# EAGLE board Titan_6L_v1p4 (EAGLE 9.6.2), part 1 of 2
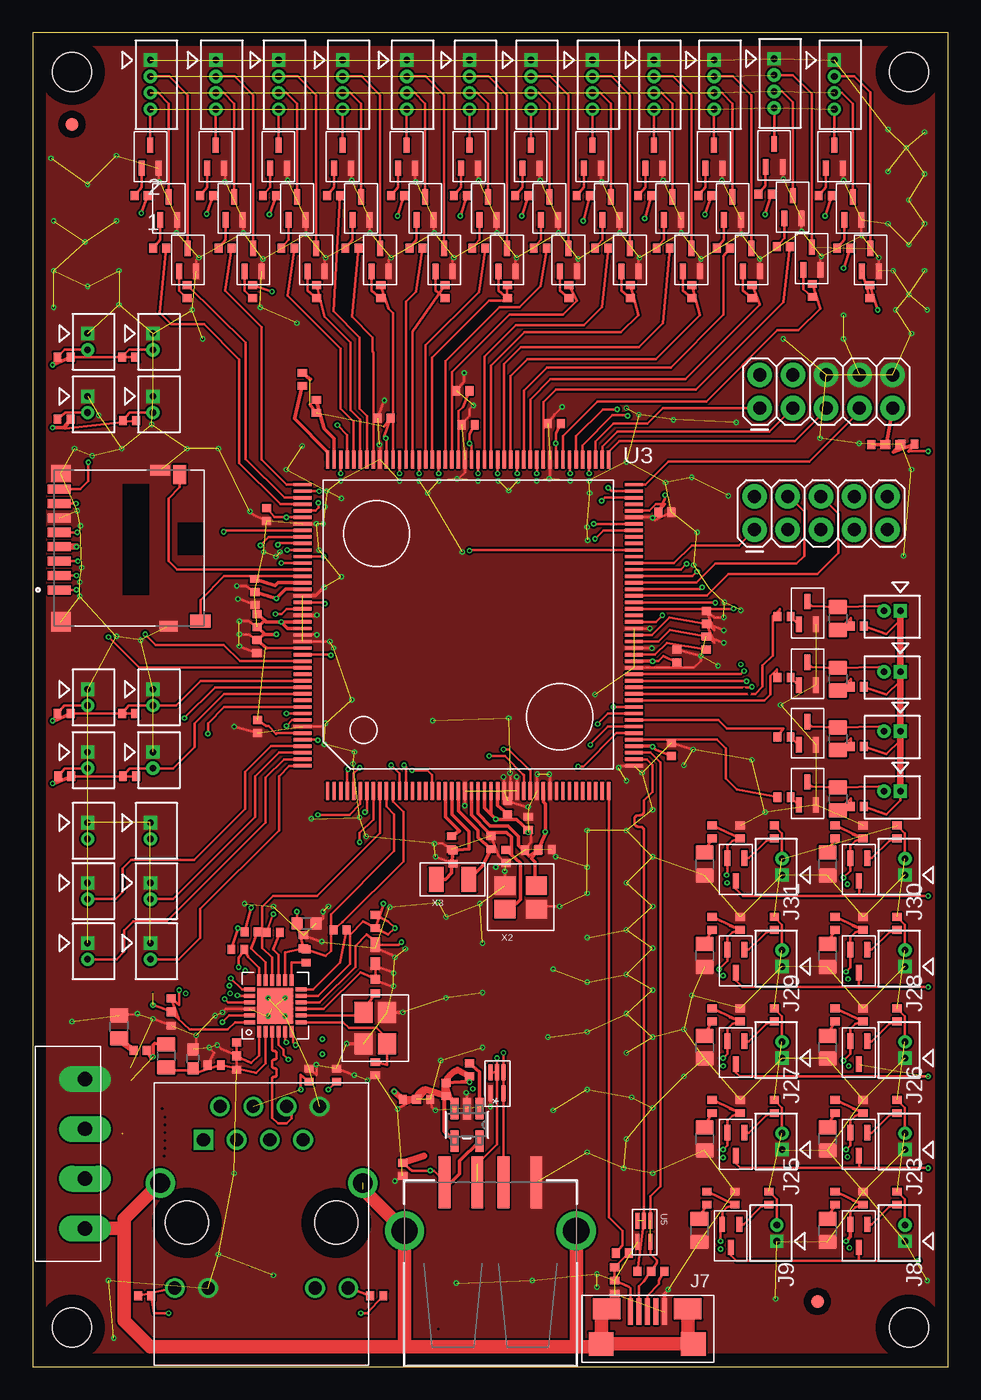
[diagram p7: board, top side]
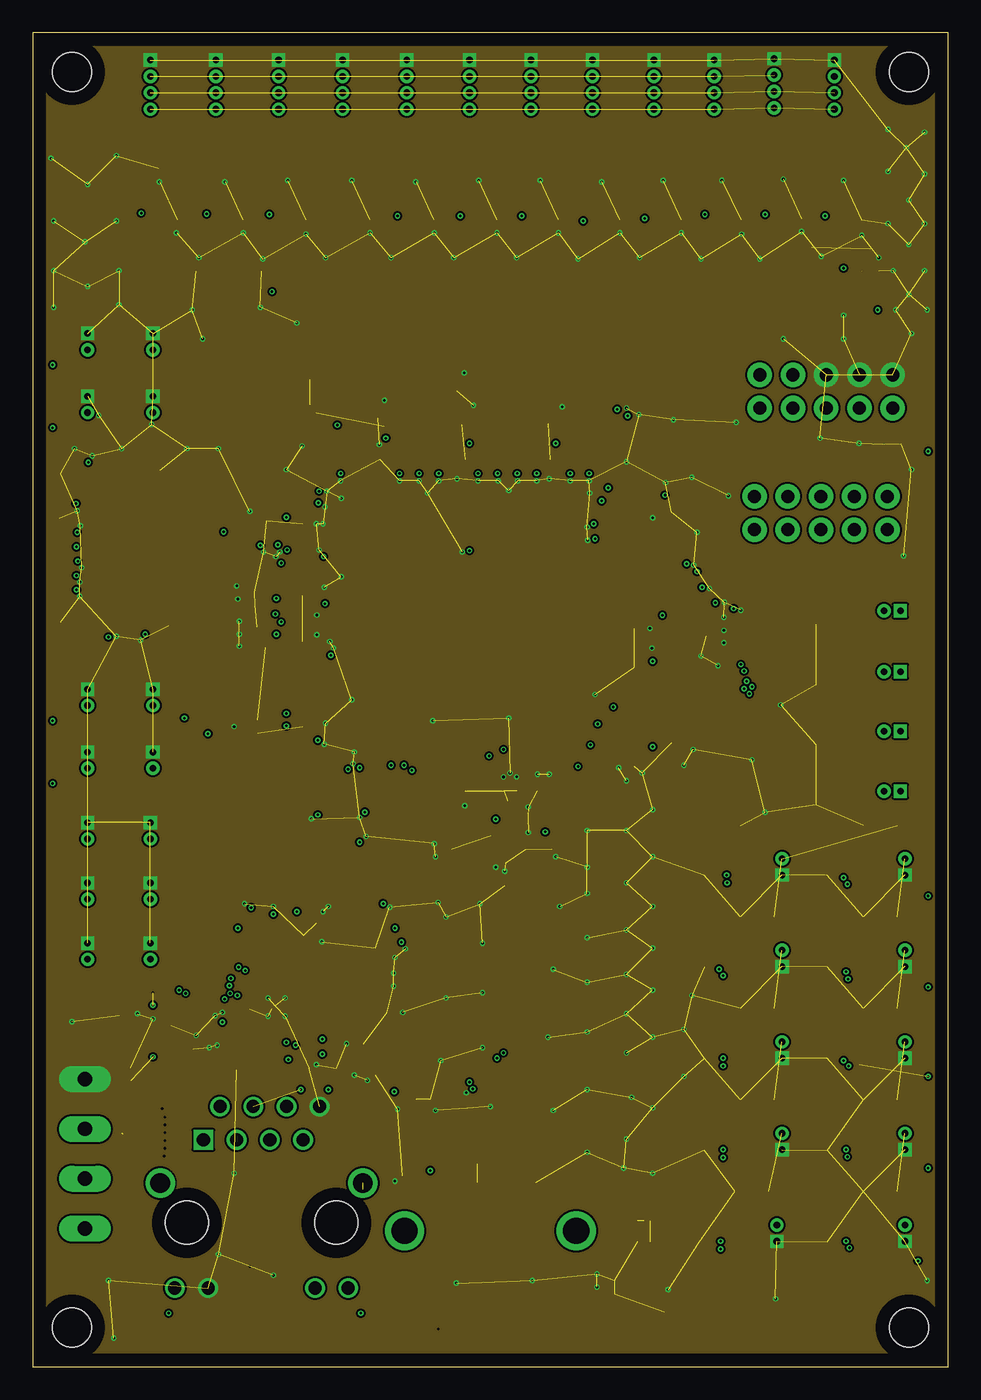
[diagram p8: board, inner layer GND]
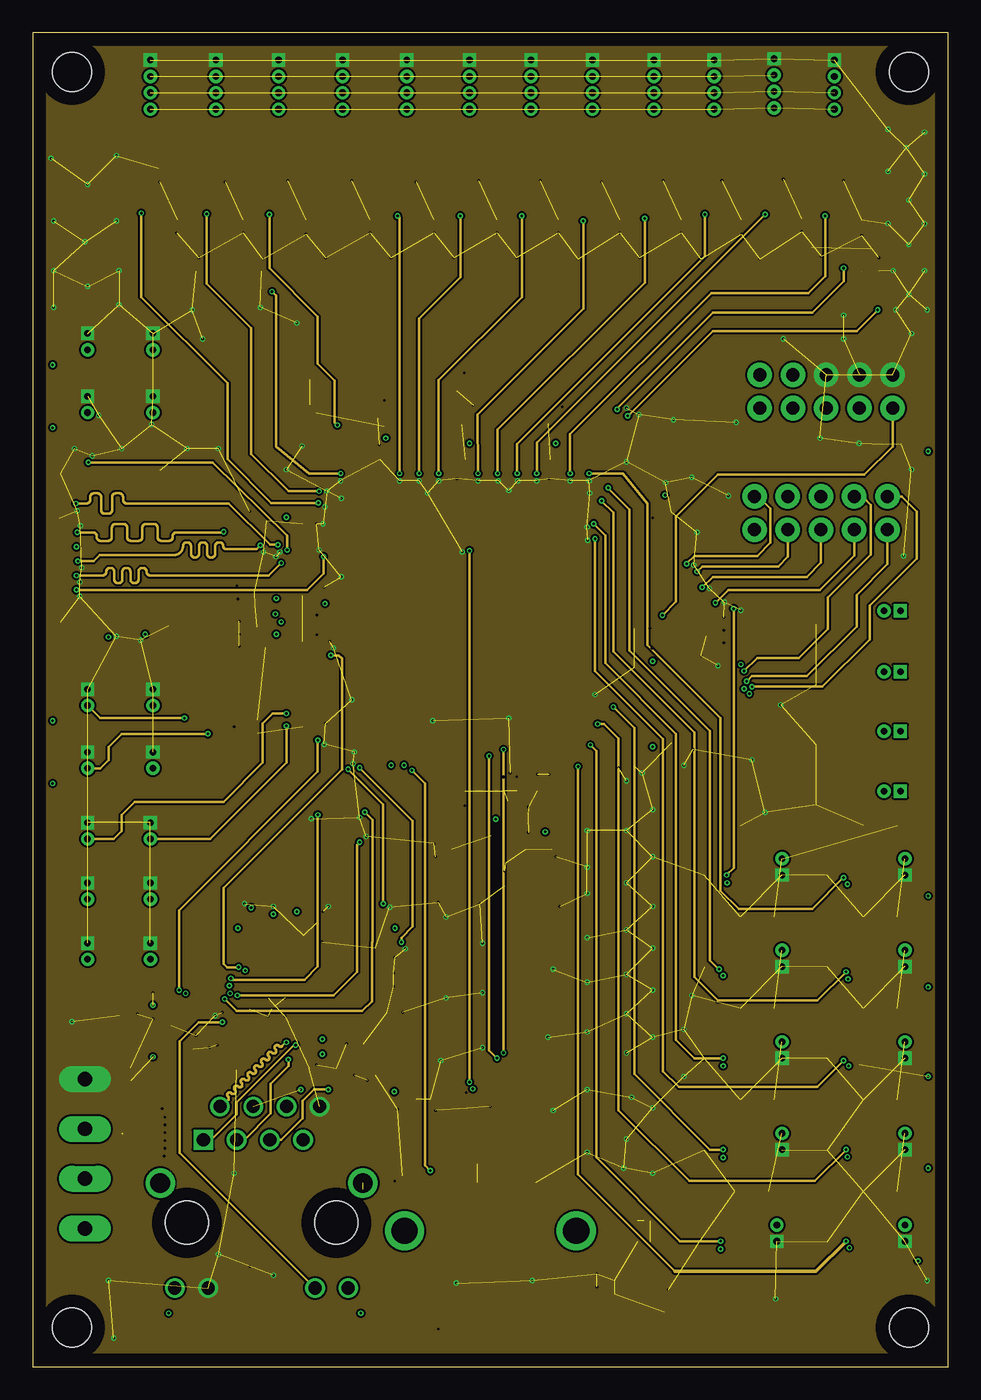
[diagram p9: board, inner layer Route3]
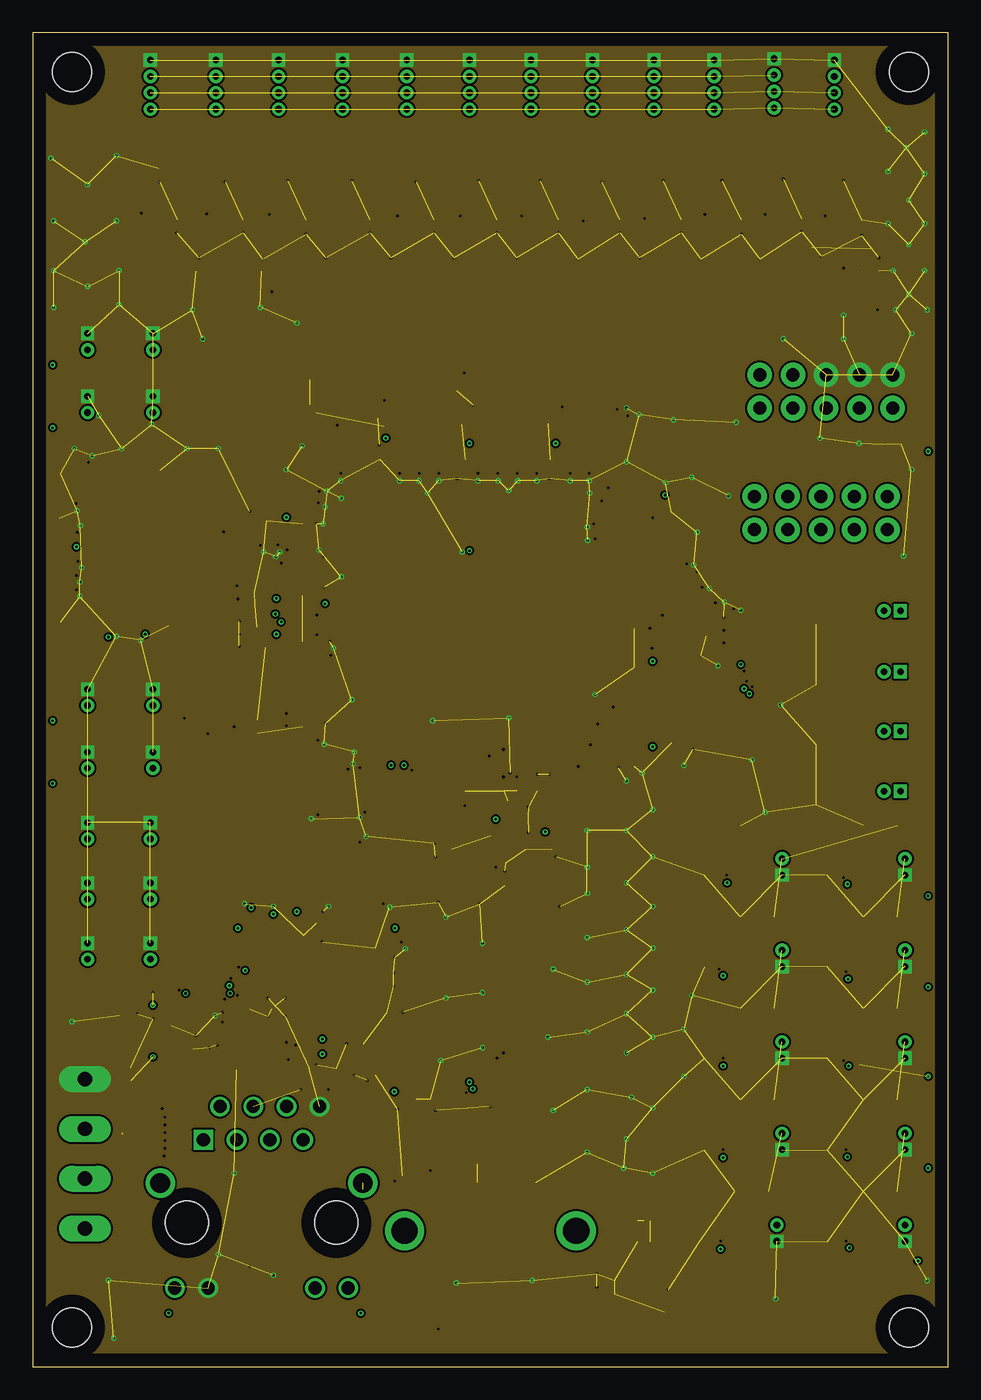
[diagram p10: board, inner layer GND14]
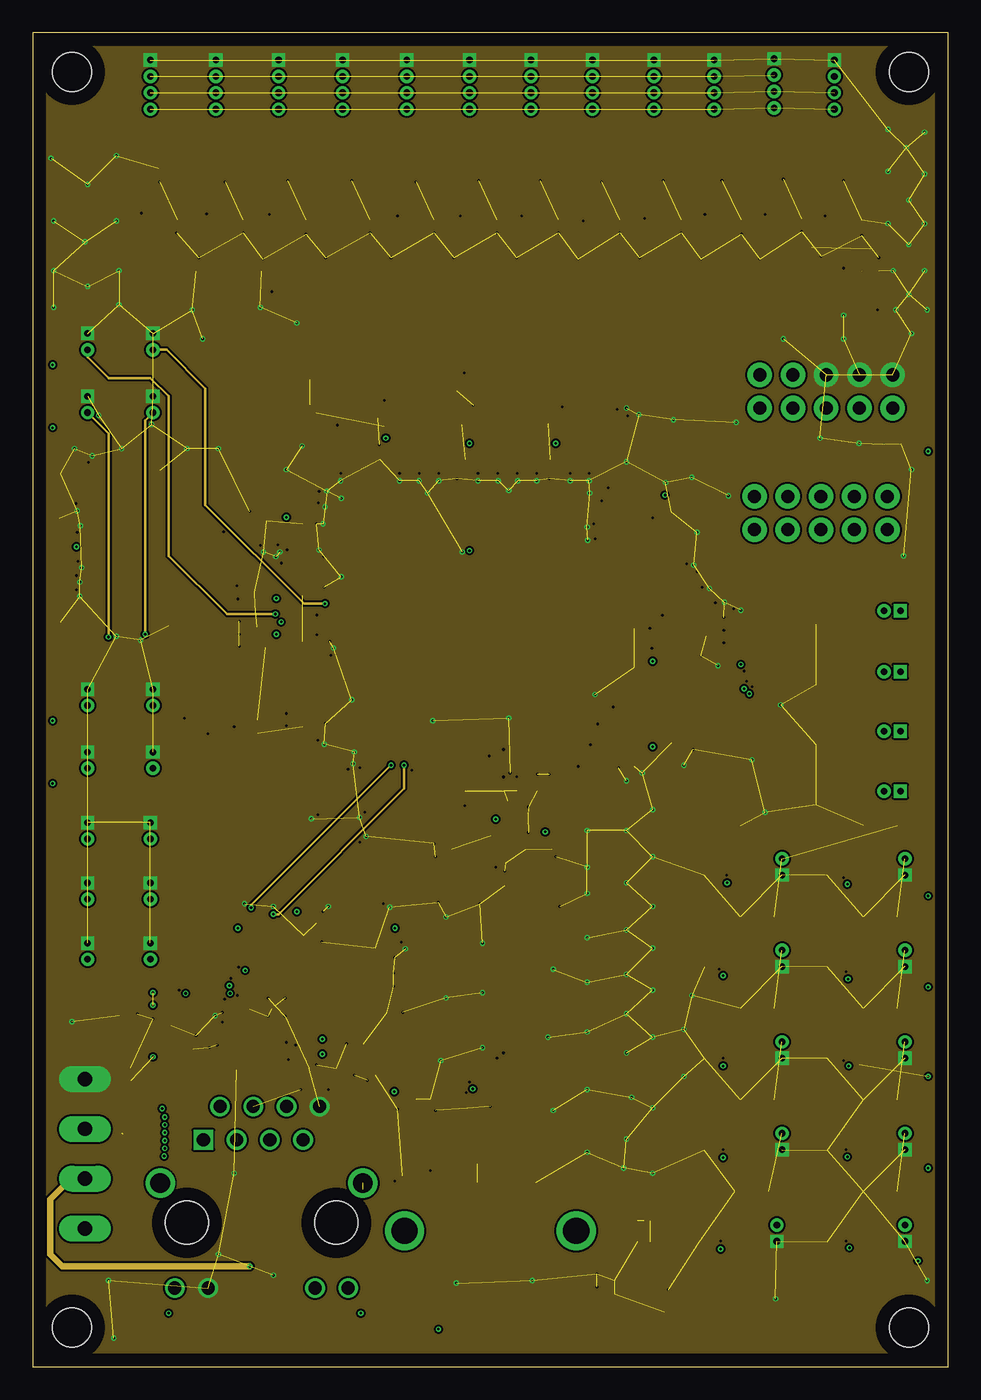
[diagram p11: board, inner layer Route15]
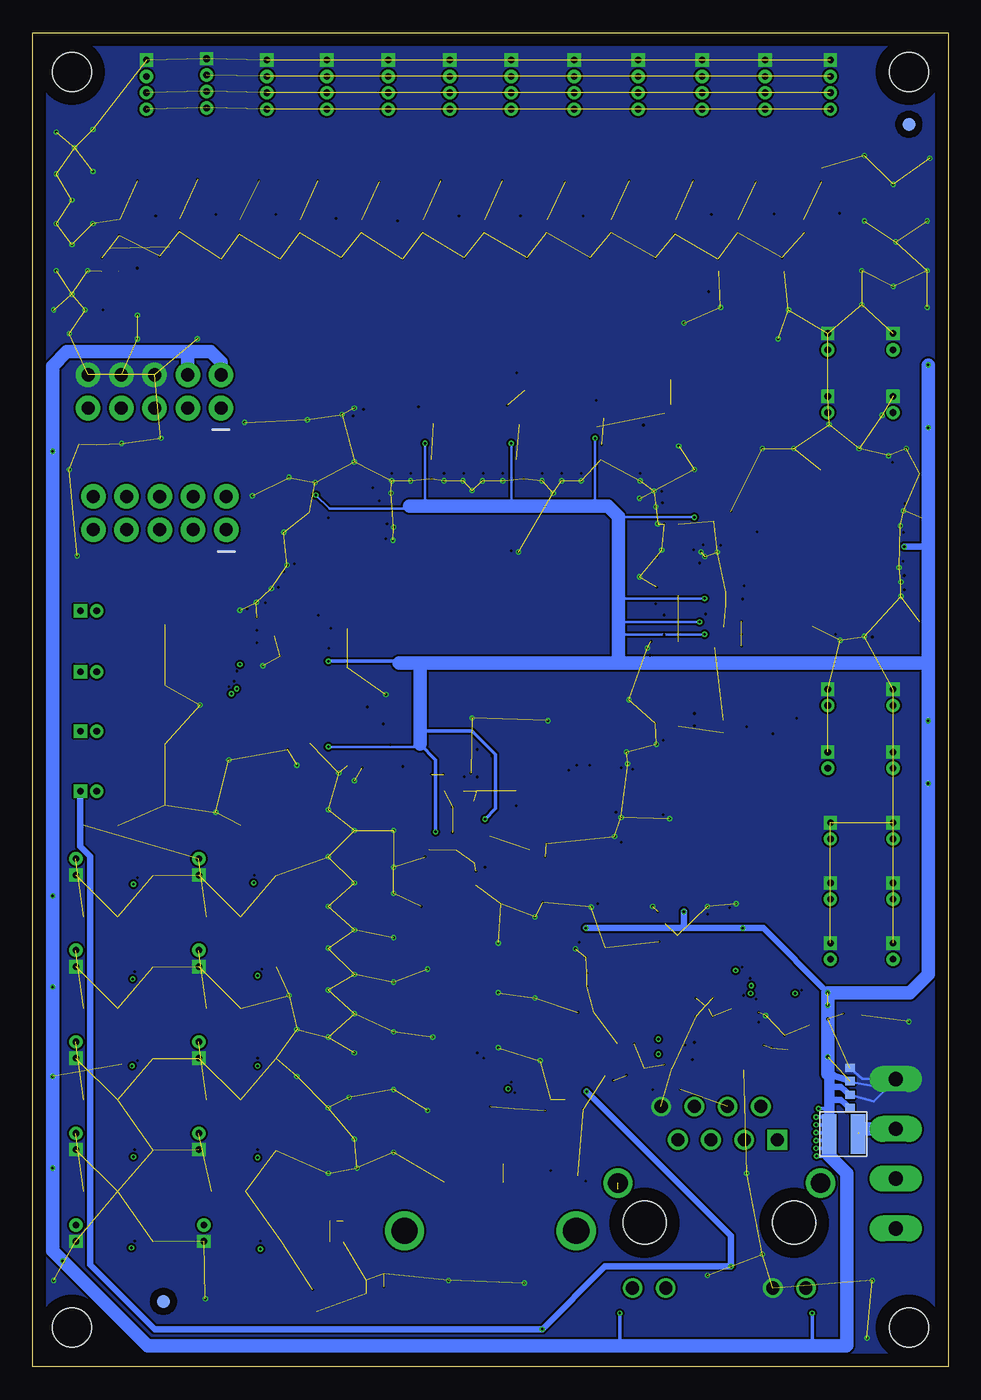
[diagram p12: board, bottom side, seen from below]

Size 70 x 102 mm. Coordinates in mm from the lower left corner, seen from the top.
Outline: 0,0 70,0 70,102 0,102 0,0
Copper layers ([3:[2:[15:1+2*3+14*15+16:2]:15]]): Top 0.0348mm / dielectric 0.1mm / GND 0.0348mm / dielectric 0.546mm / Route3 0.0348mm / dielectric 0.1mm / GND14 0.0348mm / dielectric 0.546mm / Route15 0.0348mm / dielectric 0.1mm / Bottom 0.0348mm
Design rules "default *": minimum track width 6mil, minimum drill 0.2mm, track to track 6mil, track to pad 6mil, pad to pad 6mil, via to via 6mil, smd to smd 6mil, copper to edge 40mil, drill to drill 6mil, minimum pad ring 10mil, minimum via ring 4mil, stop-mask expansion 4mil, vias tented up to drill 0mil, thermal gap 10mil
Holes 3 mm at 3,99 67,99 67,3 3,3

## Footprints (pad centres in the part's own frame; a part is rotated, then mirrored left to right if it is on the bottom)
FIDUCIAL_1MM = smd 1 x 1: 1 0,0
0402 = smd 0.6 x 0.7: 1 -0.5,0; 2 0.5,0
0603 = smd 0.95 x 0.95: 1 -0.725,0; 2 0.725,0
0805 = smd 1.1 x 1.4: 1 -0.875,0; 2 0.875,0
SD_CARD = smd 0.7 x 1.75: 1 3.2,-5.285; 2 2.1,-5.285; 3 1,-5.285; 4 -0.1,-5.285; 5 -1.2,-5.285; 6 -2.3,-5.285; 7 -3.4,-5.285; 8 -4.5,-5.285 | smd 1 x 1.55: 9 5.575,5.515 | smd 1.45 x 1: 10 -5.625,3.94 | smd 1.5 x 1.5: S1 5.65,-5.16 | smd 1.3 x 1.5: S2 -5.7,-5.16 | smd 0.8 x 1.4: S3 5.975,3.09 | smd 0.8 x 1.5: S4 -5.95,2.44
1X4_3.81MM_PITCH = drill 1.1 pad 2 long: P$1 0,0; P$2 3.81,0; P$3 7.62,0; P$4 11.43,0
2X5 = drill 1 pad 1.88: 1 0,0; 2 0,2.54; 3 2.54,0; 4 2.54,2.54; 5 5.08,0; 6 5.08,2.54; 7 7.62,0; 8 7.62,2.54; 9 10.16,0; 10 10.16,2.54
CON_530470210_MOL = drill 0.508 pad 0.838 square: 1 0,0 | drill 0.508 pad 0.838: 2 -1.245,0
USB_A_SMT = smd 4 x 0.9: D+ 6.7,-1; D- 6.7,1; GND 6.7,-3.5; VBUS 6.7,3.5 | drill 2: SHLD1 3,-6.566; SHLD2 3,6.566
USB_MICRO-B = smd 0.4 x 2: P$1 -1.3,2.475; P$2 -0.65,2.475; P$3 0,2.475; P$4 0.65,2.475; P$5 1.3,2.475 | smd 2.1 x 1.6: P$6 -3.1,2.675; P$7 3.1,2.675 | smd 1.9 x 1.8: P$8 -3.525,0; P$9 3.525,0
CON_530470410_MOL = drill 0.508 pad 0.838 square: 1 0,0 | drill 0.508 pad 0.838: 2 -1.245,0; 3 -2.489,0; 4 -3.759,0
1008 = smd 3 x 1.1: 1 0,1.1; 2 0,-1.1
SOT-23-5 = smd 1.626 x 0.61: 1 -1.245,0.95; 2 -1.245,0; 3 -1.245,-0.95; 4 1.245,-0.95; 5 1.245,0.95
LQFP176_24X24 = smd 1.372 x 0.254: 1 -12.675,10.75; 2 -12.675,10.25; 3 -12.675,9.75; 4 -12.675,9.25; 5 -12.675,8.75; 6 -12.675,8.25; 7 -12.675,7.75; 8 -12.675,7.25; 9 -12.675,6.75; 10 -12.675,6.25; 11 -12.675,5.75; 12 -12.675,5.25; 13 -12.675,4.75; 14 -12.675,4.25; 15 -12.675,3.75; 16 -12.675,3.25; 17 -12.675,2.75; 18 -12.675,2.25; 19 -12.675,1.75; 20 -12.675,1.25; 21 -12.675,0.75; 22 -12.675,0.25; 23 -12.675,-0.25; 24 -12.675,-0.75; 25 -12.675,-1.25; 26 -12.675,-1.75; 27 -12.675,-2.25; 28 -12.675,-2.75; 29 -12.675,-3.25; 30 -12.675,-3.75; 31 -12.675,-4.25; 32 -12.675,-4.75; 33 -12.675,-5.25; 34 -12.675,-5.75; 35 -12.675,-6.25; 36 -12.675,-6.75; 37 -12.675,-7.25; 38 -12.675,-7.75; 39 -12.675,-8.25; 40 -12.675,-8.75; 41 -12.675,-9.25; 42 -12.675,-9.75; 43 -12.675,-10.25; 44 -12.675,-10.75; 89 12.675,-10.75; 90 12.675,-10.25; 91 12.675,-9.75; 92 12.675,-9.25; 93 12.675,-8.75; 94 12.675,-8.25; 95 12.675,-7.75; 96 12.675,-7.25; 97 12.675,-6.75; 98 12.675,-6.25; 99 12.675,-5.75; 100 12.675,-5.25; 101 12.675,-4.75; 102 12.675,-4.25; 103 12.675,-3.75; 104 12.675,-3.25; 105 12.675,-2.75; 106 12.675,-2.25; 107 12.675,-1.75; 108 12.675,-1.25; 109 12.675,-0.75; 110 12.675,-0.25; 111 12.675,0.25; 112 12.675,0.75; 113 12.675,1.25; 114 12.675,1.75; 115 12.675,2.25; 116 12.675,2.75; 117 12.675,3.25; 118 12.675,3.75; 119 12.675,4.25; 120 12.675,4.75; 121 12.675,5.25; 122 12.675,5.75; 123 12.675,6.25; 124 12.675,6.75; 125 12.675,7.25; 126 12.675,7.75; 127 12.675,8.25; 128 12.675,8.75; 129 12.675,9.25; 130 12.675,9.75; 131 12.675,10.25; 132 12.675,10.75 | smd 0.254 x 1.372: 45 -10.75,-12.675; 46 -10.25,-12.675; 47 -9.75,-12.675; 48 -9.25,-12.675; 49 -8.75,-12.675; 50 -8.25,-12.675; 51 -7.75,-12.675; 52 -7.25,-12.675; 53 -6.75,-12.675; 54 -6.25,-12.675; 55 -5.75,-12.675; 56 -5.25,-12.675; 57 -4.75,-12.675; 58 -4.25,-12.675; 59 -3.75,-12.675; 60 -3.25,-12.675; 61 -2.75,-12.675; 62 -2.25,-12.675; 63 -1.75,-12.675; 64 -1.25,-12.675; 65 -0.75,-12.675; 66 -0.25,-12.675; 67 0.25,-12.675; 68 0.75,-12.675; 69 1.25,-12.675; 70 1.75,-12.675; 71 2.25,-12.675; 72 2.75,-12.675; 73 3.25,-12.675; 74 3.75,-12.675; 75 4.25,-12.675; 76 4.75,-12.675; 77 5.25,-12.675; 78 5.75,-12.675; 79 6.25,-12.675; 80 6.75,-12.675; 81 7.25,-12.675; 82 7.75,-12.675; 83 8.25,-12.675; 84 8.75,-12.675; 85 9.25,-12.675; 86 9.75,-12.675; 87 10.25,-12.675; 88 10.75,-12.675; 133 10.75,12.675; 134 10.25,12.675; 135 9.75,12.675; 136 9.25,12.675; 137 8.75,12.675; 138 8.25,12.675; 139 7.75,12.675; 140 7.25,12.675; 141 6.75,12.675; 142 6.25,12.675; 143 5.75,12.675; 144 5.25,12.675; 145 4.75,12.675; 146 4.25,12.675; 147 3.75,12.675; 148 3.25,12.675; 149 2.75,12.675; 150 2.25,12.675; 151 1.75,12.675; 152 1.25,12.675; 153 0.75,12.675; 154 0.25,12.675; 155 -0.25,12.675; 156 -0.75,12.675; 157 -1.25,12.675; 158 -1.75,12.675; 159 -2.25,12.675; 160 -2.75,12.675; 161 -3.25,12.675; 162 -3.75,12.675; 163 -4.25,12.675; 164 -4.75,12.675; 165 -5.25,12.675; 166 -5.75,12.675; 167 -6.25,12.675; 168 -6.75,12.675; 169 -7.25,12.675; 170 -7.75,12.675; 171 -8.25,12.675; 172 -8.75,12.675; 173 -9.25,12.675; 174 -9.75,12.675; 175 -10.25,12.675; 176 -10.75,12.675
DRL5 = smd 1.219 x 0.305: 1 -0.8,0.5; 2 -0.8,0; 3 -0.8,-0.5; 4 0.8,-0.5; 5 0.8,0.5
QFN-24-M = smd 0.864 x 0.305: 1 -1.968,1.25; 2 -1.968,0.75; 3 -1.968,0.25; 4 -1.968,-0.25; 5 -1.968,-0.75; 6 -1.968,-1.25; 13 1.968,-1.25; 14 1.968,-0.75; 15 1.968,-0.25; 16 1.968,0.25; 17 1.968,0.75; 18 1.968,1.25 | smd 0.305 x 0.864: 7 -1.25,-1.968; 8 -0.75,-1.968; 9 -0.25,-1.968; 10 0.25,-1.968; 11 0.75,-1.968; 12 1.25,-1.968; 19 1.25,1.968; 20 0.75,1.968; 21 0.25,1.968; 22 -0.25,1.968; 23 -0.75,1.968; 24 -1.25,1.968 | smd 2.743 x 2.743: 25 0,0
SOT323 = smd 0.457 x 1.168: 1 -0.65,-0.876; 2 0.65,-0.876; 3 0,0.876
RJ45_TH_ELEC = drill 1 square: 1 -4.45,-2.54 | drill 1: 2 -3.18,0; 3 -1.91,-2.54; 4 -0.635,0; 5 0.635,-2.54; 6 1.91,0; 7 3.17,-2.54; 8 4.445,0; 9 -6.63,-13.88; 10 -4.09,-13.88; 11 4.09,-13.88; 12 6.63,-13.88 | drill 1.5: 13 -7.75,-5.84; 14 7.75,-5.84 | hole 3.299: 5.715,-8.89; -5.715,-8.89
SMD_3225 = smd 1.6 x 1.4: 1 -1.2,-0.9; 2 1.2,-0.9; 3 1.2,0.9; 4 -1.2,0.9
SMD_X_2_PADS = smd 1.9 x 1.1: P$1 0,1.25; P$2 0,-1.25

## Placement (x,y rotation side)
AFID1  FIDUCIAL_1MM  [FIDUCIAL_1MM]  60,5 0 top
AFID2  FIDUCIAL_1MM  [FIDUCIAL_1MM]  3,95 0 top
AFID4  FIDUCIAL_1MM  [FIDUCIAL_1MM]  60,5 0 bottom
AFID5  FIDUCIAL_1MM  [FIDUCIAL_1MM]  3,95 0 bottom
C4  0.1uF  [0402]  7.5,22.35 90 bottom
C5  10uF  [0402]  7.5,21.3 90 bottom
C6  0.1uF  [0402]  49.25,54.35 90 top
C7  0.1uF  [0402]  7.5,20.3 90 bottom
C13  0.1uF  [0402]  21.13,22.3 90 top
C14  0.1uF  [0402]  23.23,22.3 90 top
C15  24pF  [0402]  26.2,22.8 270 top
C16  10uF  [0402]  64.62,70.5 0 top
C17  18pF  [0402]  36.2,39.03 270 top
C18  18pF  [0402]  38.13,39.5 180 top
C19  0.1uF  [0402]  17,58.75 90 top
C20  0.1uF  [0402]  17.89,65.15 90 top
C21  1uF  [0402]  17.16,56.05 90 top
C22  0.1uF  [0402]  17.15,57.05 90 top
C23  10uF  [0402]  29.9,20.45 0 top
C24  0.1uF  [0402]  16.98,59.74 90 top
C25  0.1uF  [0402]  17.14,55.08 90 top
C26  0.1uF  [0402]  28.8,20.45 0 top
C27  0.1uF  [0402]  17.19,48.95 90 top
C28  1uF  [0402]  44.5,7.1 270 top
C29  0.1uF  [0402]  28.3,15.1 270 top
C30  0.1uF  [0402]  26.87,72.52 0 top
C32  12pF  [0402]  32.14,38.97 270 top
C33  0.1uF  [0402]  32.02,40.07 270 top
C34  0.1uF  [0402]  32.89,74.62 0 top
C35  0.1uF  [0402]  33.3,72.02 0 top
C36  0.1uF  [0402]  37.89,41.56 90 top
C37  12pF  [0402]  35.03,40.07 90 top
C38  0.1uF  [0402]  39.89,72.11 0 top
C39  0.1uF  [0402]  39.19,39.55 0 top
C40  0.1uF  [0402]  66.94,70.55 180 top
C41  1uF  [0402]  48.34,65.34 0 top
C42  0.1uF  [0402]  51.5,55.35 90 top
C43  0.1uF  [0402]  48.84,47.19 270 top
C44  24pF  [0402]  26.2,29.06 90 top
C45  22uF  [0603]  12.26,23.54 90 top
C46  0.1uF  [0402]  13.89,23.07 180 top
C47  2.2uF  [0402]  15.6,23.22 270 top
C48  .1uF  [0402]  15.6,24.3 270 top
C49  100pF  [0402]  26.2,30.16 90 top
C50  22uF  [0603]  20.95,33.9 0 top
C51  0.1uF  [0402]  20.7,32.5 90 top
FB2/2  120Ohm  [0805]  10.22,23.77 270 top
J1  SD_CARD  [SD_CARD]  7.31,62.6 270 top
J2  4-pos  [1X4_3.81MM_PITCH]  4,22 270 top
J3  10-pos  [2X5]  55.6,73.3 0 top
J4  [CON_530470210_MOL]  4.2,37 90 top
J5  [CON_530470210_MOL]  9,37 90 top
J6  USB-A  [USB_A_SMT]  35,7.4 90 top
J7  USB-B-Micro  [USB_MICRO-B]  47,1.75 0 top
J8  [CON_530470210_MOL]  66.7,9.6 270 top
J9  [CON_530470210_MOL]  56.9,9.6 270 top
J10  CONN_530470410_PICOBLADE_X_4  [CON_530470410_MOL]  9,99.91 90 top
J11  [CON_530470210_MOL]  66.35,44 0 top
J12  10-pos  [2X5]  55.2,64 0 top
J13  CONN_530470410_PICOBLADE_X_4  [CON_530470410_MOL]  14,99.91 90 top
J14  CONN_530470410_PICOBLADE_X_4  [CON_530470410_MOL]  18.8,99.91 90 top
J15  CONN_530470410_PICOBLADE_X_4  [CON_530470410_MOL]  23.7,99.91 90 top
J16  CONN_530470410_PICOBLADE_X_4  [CON_530470410_MOL]  28.6,99.91 90 top
J17  CONN_530470410_PICOBLADE_X_4  [CON_530470410_MOL]  47.5,99.91 90 top
J18  CONN_530470410_PICOBLADE_X_4  [CON_530470410_MOL]  33.4,99.91 90 top
J19  CONN_530470410_PICOBLADE_X_4  [CON_530470410_MOL]  61.3,99.91 90 top
J20  CONN_530470410_PICOBLADE_X_4  [CON_530470410_MOL]  38.1,99.91 90 top
J21  CONN_530470410_PICOBLADE_X_4  [CON_530470410_MOL]  52.1,99.91 90 top
J22  CONN_530470410_PICOBLADE_X_4  [CON_530470410_MOL]  42.8,99.91 90 top
J23  [CON_530470210_MOL]  66.7,16.6 270 top
J24  CONN_530470410_PICOBLADE_X_4  [CON_530470410_MOL]  56.7,100.01 90 top
J25  [CON_530470210_MOL]  57.3,16.6 270 top
J26  [CON_530470210_MOL]  66.7,23.6 270 top
J27  [CON_530470210_MOL]  57.3,23.6 270 top
J28  [CON_530470210_MOL]  66.7,30.6 270 top
J29  [CON_530470210_MOL]  57.3,30.6 270 top
J30  [CON_530470210_MOL]  66.7,37.6 270 top
J31  [CON_530470210_MOL]  57.3,37.6 270 top
J32  [CON_530470210_MOL]  66.35,48.6 0 top
J33  [CON_530470210_MOL]  66.35,53.15 0 top
J34  [CON_530470210_MOL]  66.35,57.8 0 top
J35  [CON_530470210_MOL]  4.2,41.6 90 top
J36  [CON_530470210_MOL]  4.2,32.4 90 top
J37  [CON_530470210_MOL]  9,32.4 90 top
J38  [CON_530470210_MOL]  9,41.6 90 top
L1  2.2uH  [1008]  8,17.8 270 bottom
LED1  Green  [0805]  6.6,26 90 top
LED3  Green  [0805]  60.78,10.44 270 top
LED4  Green  [0805]  50.98,10.44 270 top
LED5  Green  [0805]  61.58,43.42 90 top
LED6  Green  [0805]  60.78,17.44 270 top
LED7  Green  [0805]  51.38,17.44 270 top
LED8  Green  [0805]  60.78,24.44 270 top
LED9  Green  [0805]  51.38,24.44 270 top
LED10  Green  [0805]  60.78,31.44 270 top
LED11  Green  [0805]  51.38,31.44 270 top
LED12  Green  [0805]  60.78,38.44 270 top
LED13  Green  [0805]  51.38,38.44 270 top
LED14  Green  [0805]  61.58,48.02 90 top
LED15  Green  [0805]  61.58,52.57 90 top
LED16  Green  [0805]  61.58,57.22 90 top
R1  100K  [0402]  2.45,45.15 0 top
R2  100K  [0402]  7.4,45.15 0 top
R3  500R0  [0402]  57.45,43.55 0 top
R4  2.2K  [0402]  66.1,12.9 270 top
R5  470R0  [0402]  8.22,24.19 0 top
R6  470R0  [0402]  61.36,12.9 90 top
R7  10K0  [0402]  63.5,12.9 270 top
R8  2.2K  [0402]  56.3,12.9 270 top
R9  470R0  [0402]  51.56,12.9 90 top
R10  10K0  [0402]  53.7,12.9 270 top
R11  470R0  [0402]  63.06,42.84 0 top
R12  500R0  [0402]  57.45,48.15 0 top
R13  10K0  [0402]  65.77,70.5 0 top
R14  1K0  [0402]  20.62,75.5 270 top
R15  1K0  [0402]  21.68,73.43 90 top
R16  15K0  [0402]  45.1,8.7 0 top
R17  27R0  [0402]  46.75,7.3 0 top
R18  27R0  [0402]  47.8,7.3 0 top
R19  10K0  [0402]  31.6,21.2 270 top
R20  10K0  [0402]  33.4,22.7 270 top
R21  30K0  [0402]  44.5,6.1 90 top
R22  2K2  [0402]  36.31,42.75 270 top
R23  10K0  [0402]  51.52,56.32 270 top
R24  10K0  [0402]  51.51,57.28 270 top
R25  470  [0402]  26.31,5.43 0 top
R26  470  [0402]  8.56,5.43 0 top
R27  470R0  [0402]  63.06,47.44 0 top
R28  33R0  [0402]  8.3,89.55 180 top
R29  33R0  [0402]  9.71,85.53 180 top
R30  33R0  [0402]  11.82,82.2 270 top
R31  33R0  [0402]  13.3,89.55 180 top
R32  33R0  [0402]  14.71,85.53 180 top
R33  33R0  [0402]  16.82,82.2 270 top
R34  33R0  [0402]  18.1,89.55 180 top
R35  33R0  [0402]  19.51,85.53 180 top
R36  33R0  [0402]  21.72,82.2 270 top
R37  33R0  [0402]  23,89.55 180 top
R38  33R0  [0402]  24.41,85.53 180 top
R39  33R0  [0402]  26.62,82.2 270 top
R40  33R0  [0402]  27.9,89.55 180 top
R41  33R0  [0402]  29.31,85.53 180 top
R42  33R0  [0402]  31.52,82.2 270 top
R43  33R0  [0402]  46.8,89.55 180 top
R44  33R0  [0402]  48.21,85.53 180 top
R45  33R0  [0402]  50.42,82.2 270 top
R46  33R0  [0402]  32.7,89.55 180 top
R47  33R0  [0402]  34.11,85.53 180 top
R48  33R0  [0402]  36.32,82.2 270 top
R49  33R0  [0402]  60.6,89.55 180 top
R50  33R0  [0402]  62.01,85.53 180 top
R51  33R0  [0402]  64.02,82.2 270 top
R52  33R0  [0402]  37.4,89.55 180 top
R53  33R0  [0402]  38.81,85.53 180 top
R54  33R0  [0402]  41.02,82.2 270 top
R55  33R0  [0402]  51.4,89.55 180 top
R56  33R0  [0402]  52.81,85.53 180 top
R57  33R0  [0402]  55.02,82.2 270 top
R58  33R0  [0402]  42.1,89.55 180 top
R59  33R0  [0402]  43.51,85.53 180 top
R60  33R0  [0402]  45.72,82.2 270 top
R61  2.2K  [0402]  66.1,19.9 270 top
R62  470R0  [0402]  61.36,19.9 90 top
R63  10K0  [0402]  63.5,19.9 270 top
R64  33R0  [0402]  56,89.65 180 top
R65  33R0  [0402]  57.41,85.63 180 top
R66  33R0  [0402]  59.62,82.3 270 top
R67  2.2K  [0402]  56.7,19.9 270 top
R68  470R0  [0402]  51.96,19.9 90 top
R69  10K0  [0402]  54.1,19.9 270 top
R70  2.2K  [0402]  66.1,26.9 270 top
R71  470R0  [0402]  61.36,26.9 90 top
R72  10K0  [0402]  63.5,26.9 270 top
R73  2.2K  [0402]  56.7,26.9 270 top
R74  6k49  [0402]  26.2,31.51 270 top
R75  10K  [0402]  15.69,31.92 180 top
R76  470R0  [0402]  51.96,26.9 90 top
R77  10K0  [0402]  54.1,26.9 270 top
R78  2.2K  [0402]  66.1,33.9 270 top
R79  470R0  [0402]  61.36,33.9 90 top
R80  10K0  [0402]  63.5,33.9 270 top
R81  2.2K  [0402]  56.7,33.9 270 top
R82  470R0  [0402]  51.96,33.9 90 top
R83  10K0  [0402]  54.1,33.9 270 top
R84  2.2K  [0402]  66.1,40.9 270 top
R85  470R0  [0402]  61.36,40.9 90 top
R86  10K0  [0402]  63.5,40.9 270 top
R87  10K  [0402]  10.58,27.66 270 top
R88  2.2K  [0402]  56.7,40.9 270 top
R89  470R0  [0402]  51.96,40.9 90 top
R90  10K0  [0402]  54.1,40.9 270 top
R91  500R0  [0402]  57.45,52.7 0 top
R92  470R0  [0402]  63.06,51.99 0 top
R93  500R0  [0402]  57.45,57.35 0 top
R94  1K50  [0402]  26.2,34.04 90 top
R95  470R0  [0402]  63.06,56.64 0 top
R96  100K  [0402]  2.4,77.2 0 top
R97  100K  [0402]  7.35,77.2 0 top
R100  1K50  [0402]  26.2,33.04 90 top
R101  33  [0402]  23.5,33.4 0 top
R102  100K  [0402]  2.4,49.95 0 top
R103  100K  [0402]  7.35,49.95 0 top
R105  100K  [0402]  2.4,72.45 0 top
R106  100K  [0402]  7.4,72.35 0 top
R107  33  [0402]  20.9,31.4 270 top
R108  33  [0402]  16.7,33.25 0 top
R109  33  [0402]  18.4,33.2 0 top
TH01  [CON_530470210_MOL]  4.2,47 90 top
TH02  [CON_530470210_MOL]  9.2,47 90 top
TH03  [CON_530470210_MOL]  4.2,51.8 90 top
TH04  [CON_530470210_MOL]  9.2,51.8 90 top
TH05  [CON_530470210_MOL]  4.2,74.2 90 top
TH06  [CON_530470210_MOL]  9.2,74.2 90 top
TH07  [CON_530470210_MOL]  4.2,79 90 top
TH08  [CON_530470210_MOL]  9.2,79 90 top
U2  AP2151DWG-7  [SOT-23-5]  33.2,18.5 270 top
U3  S7G2LQFP176  [LQFP176_24X24]  33.3,56.7 90 top
U4  TVS-Diode  [DRL5]  35.5,21.7 270 top
U5  TVS-Diode  [DRL5]  46.75,10.35 270 top
U6  KSZ8081_QFN_24  [QFN-24-M]  18.55,27.6 90 top
U7  BC846BW  [SOT323]  63.17,10.02 180 top
U8  BC846BW  [SOT323]  53.37,10.02 180 top
U9  BC846BW  [SOT323]  8.99,92.52 0 top
U10  BC846BW  [SOT323]  10.41,88.57 0 top
U11  BC846BW  [SOT323]  11.86,84.63 0 top
U12  BC846BW  [SOT323]  13.99,92.52 0 top
U13  BC846BW  [SOT323]  15.41,88.57 0 top
U14  BC846BW  [SOT323]  16.86,84.63 0 top
U15  BC846BW  [SOT323]  18.79,92.52 0 top
U16  BC846BW  [SOT323]  20.21,88.57 0 top
U17  BC846BW  [SOT323]  21.66,84.63 0 top
U18  BC846BW  [SOT323]  23.69,92.52 0 top
U19  BC846BW  [SOT323]  25.11,88.57 0 top
U20  BC846BW  [SOT323]  26.56,84.63 0 top
U21  BC846BW  [SOT323]  28.59,92.52 0 top
U22  BC846BW  [SOT323]  30.01,88.57 0 top
U23  BC846BW  [SOT323]  31.46,84.63 0 top
U24  BC846BW  [SOT323]  47.49,92.52 0 top
U25  BC846BW  [SOT323]  48.91,88.57 0 top
U26  BC846BW  [SOT323]  50.36,84.63 0 top
U27  BC846BW  [SOT323]  33.39,92.52 0 top
U28  BC846BW  [SOT323]  34.81,88.57 0 top
U29  BC846BW  [SOT323]  36.26,84.63 0 top
U30  BC846BW  [SOT323]  61.29,92.52 0 top
U31  BC846BW  [SOT323]  62.71,88.57 0 top
U32  BC846BW  [SOT323]  64.06,84.63 0 top
U33  BC846BW  [SOT323]  38.09,92.52 0 top
U34  BC846BW  [SOT323]  39.51,88.57 0 top
U35  BC846BW  [SOT323]  40.96,84.63 0 top
U36  BC846BW  [SOT323]  52.09,92.52 0 top
U37  BC846BW  [SOT323]  53.51,88.57 0 top
U38  BC846BW  [SOT323]  54.96,84.63 0 top
U39  BC846BW  [SOT323]  42.79,92.52 0 top
U40  BC846BW  [SOT323]  44.21,88.57 0 top
U41  BC846BW  [SOT323]  45.66,84.63 0 top
U42  BC846BW  [SOT323]  59.25,43.84 0 top
U43  BC846BW  [SOT323]  63.17,17.02 180 top
U44  BC846BW  [SOT323]  53.77,17.02 180 top
U45  BC846BW  [SOT323]  56.69,92.62 0 top
U46  BC846BW  [SOT323]  58.11,88.67 0 top
U47  BC846BW  [SOT323]  59.56,84.73 0 top
U48  BC846BW  [SOT323]  63.17,24.02 180 top
U49  BC846BW  [SOT323]  53.77,24.02 180 top
U50  BC846BW  [SOT323]  63.17,31.02 180 top
U51  BC846BW  [SOT323]  53.77,31.02 180 top
U52  BC846BW  [SOT323]  63.17,38.02 180 top
U53  BC846BW  [SOT323]  53.77,38.02 180 top
U54  BC846BW  [SOT323]  59.25,48.44 0 top
U55  BC846BW  [SOT323]  59.25,52.99 0 top
U56  BC846BW  [SOT323]  59.25,57.64 0 top
U$2  [RJ45_TH_ELEC]  17.5,19.9 0 top
U$3  25MHz  [SMD_3225]  26.2,25.9 270 top
U$4  10uF  [0402]  10.6,26.59 270 top
X2  24MHz  [SMD_3225]  37.31,35.89 0 top
X3  32.768KHz  [SMD_X_2_PADS]  32.1,37.26 90 top